# Altium schematic sheet Sheet1.SchDoc
size A4
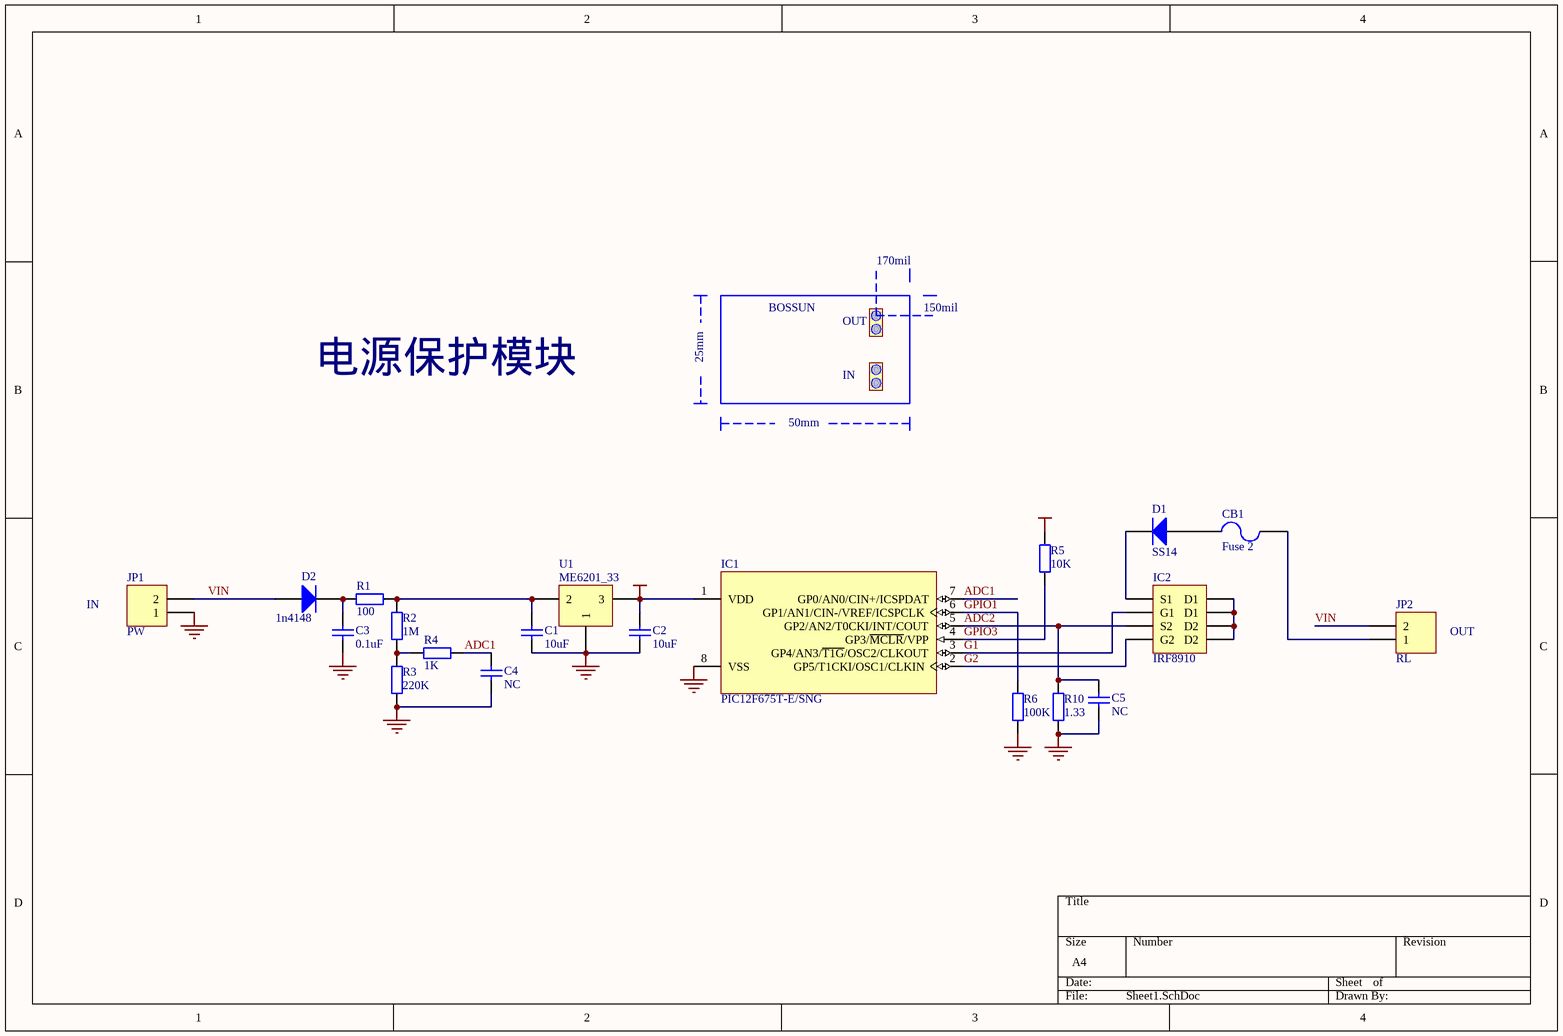
[diagram p0: Sheet1.SchDoc]

## Parts
C1  value 10uF  [0805]  (hidden comment: Cap)
C2  value 10uF  [0805]  (hidden comment: Cap)
C3  value 0.1uF  [0805]  (hidden comment: Cap)
C4  value NC  [0805]  (hidden comment: Cap)
C5  value NC  [0805]  (hidden comment: Cap)
CB1  Fuse 2  [AXIAL0.4]
D1  SS14  [1210]
D2  1n4148  [1210]
IC1  PIC12F675T-E/SNG  [SOIC150-8]
IC2  IRF8910  [so-8]
JP1  PW  [sip2]
JP2  RL  [sip2]
R1  value 100  [0805]  (hidden comment: Res2)
R2  value 1M  [0805]  (hidden comment: Res2)
R3  value 220K  [0805]  (hidden comment: Res2)
R4  value 1K  [0805]  (hidden comment: Res2)
R5  value 10K  [0805]  (hidden comment: Res2)
R6  100K  [0805]
R10  value 1.33  [AXIAL0.5]  (hidden comment: Res2)
U1  ME6201_33  [SOT-89]

## Nets
GND: C1.1 C2.1 C3.1 C4.1 C5.1 IC1.8(VSS) JP1.1 R3.1 R6.1 R10.1 U1.1
VCC: C2.2 IC1.1(VDD) R5.2 U1.3
ADC1: C4.2 IC1.7(GP0/AN0/CIN+/ICSPDAT) R4.2
ADC2: C5.2 IC1.5(GP2/AN2/T0CKI/INT/COUT) IC2.3(S2) R10.2
G1: IC1.3(GP4/AN3/~{T1G}/OSC2/CLKOUT) IC2.2(G1)
G2: IC1.2(GP5/T1CKI/OSC1/CLKIN) IC2.4(G2)
GPIO1: IC1.6(GP1/AN1/CIN-/VREF/ICSPCLK) R6.2
GPIO3: IC1.4(GP3/~{MCLR}/VPP) R5.1
VIN: D2.1(A) JP1.2 JP2.2
NetC1_2: C1.2 R1.2 R2.2 U1.2
NetC3_2: C3.2 D2.2(K) R1.1
NetCB1_1: CB1.1 D1.1(A)
NetCB1_2: CB1.2 JP2.1
NetD1_2: D1.2(K) IC2.1(S1)
NetIC2_5: IC2.5(D2) IC2.6(D2) IC2.7(D1) IC2.8(D1)
NetR2_1: R2.1 R3.2 R4.1

## Notes on the sheet
- BOSSUN
- 170mil
- 150mil
- 电源保护模块
- 25mm
- IN
- OUT
- 50mm

## Library data of the parts
C1-C5 = Cap: Capacitor; Published: 8-Jun-2000; Revision: July-2002: Re-released for DXP Platform.; Publisher: Altium Limited
CB1 = Fuse 2: Fuse; Published: 8-Jun-2000; Revision: July-2002: Re-released for DXP Platform.; Publisher: Altium Limited
D1 D2 = Diode 1N4007: 1 Amp General Purpose Rectifier; Revision 1: 11-Jul-2000: SIM Model Added.; Revision 2: 17-Jul-2002: Re-released for DXP Platform.; Package Information: Latest Revision: Aug-1999; Code - JEDEC: DO-204-AL; Published: 8-Jun-2000; Datasheet: Latest Revision: 1998; Package Reference: DO-41; Publisher: Altium Limited
IC1 = PIC12F675T-E/SNG: FLASH-Based 8-Bit CMOS Microcontroller, 10-Bit A/D, 8-Pin SOIC 150mil Lead-Free, Extended Temperature, Tape and Reel; PackageDocument: DS00049W_2003; Note: Refer to data sheet (DS41190C) for details of supply voltage range under different conditions.; Published: 11-Oct-2004; DatasheetDocument: DS41190C_2003; PackageReference: SOIC150-8; Publisher: Altium Limited; Code_JEDEC: MS-012
IC2 = Header 4X2A: Header, 4-Pin, Dual row; Revision: 17-Jul-2002: Re-released for DXP Platform.; Publisher: Altium Limited
JP1 JP2 = Header 2: Header, 2-Pin; Revision: 17-Jul-2002: Re-released for DXP Platform.; Publisher: Altium Limited
R1-R5 R10 = Res2: Resistor; Published: 8-Jun-2000; Revision: July-2002: Re-released for DXP Platform.; Publisher: Altium Limited
R6 = Res2: Resistor; Value: 1K; Published: 8-Jun-2000; Revision: July-2002: Re-released for DXP Platform.; Publisher: Altium Limited
U1 = Header 3: Header, 3-Pin; Revision: 17-Jul-2002: Re-released for DXP Platform.; Publisher: Altium Limited